# Altium schematic sheet MM32F3277_Balance.SchDoc
size A3
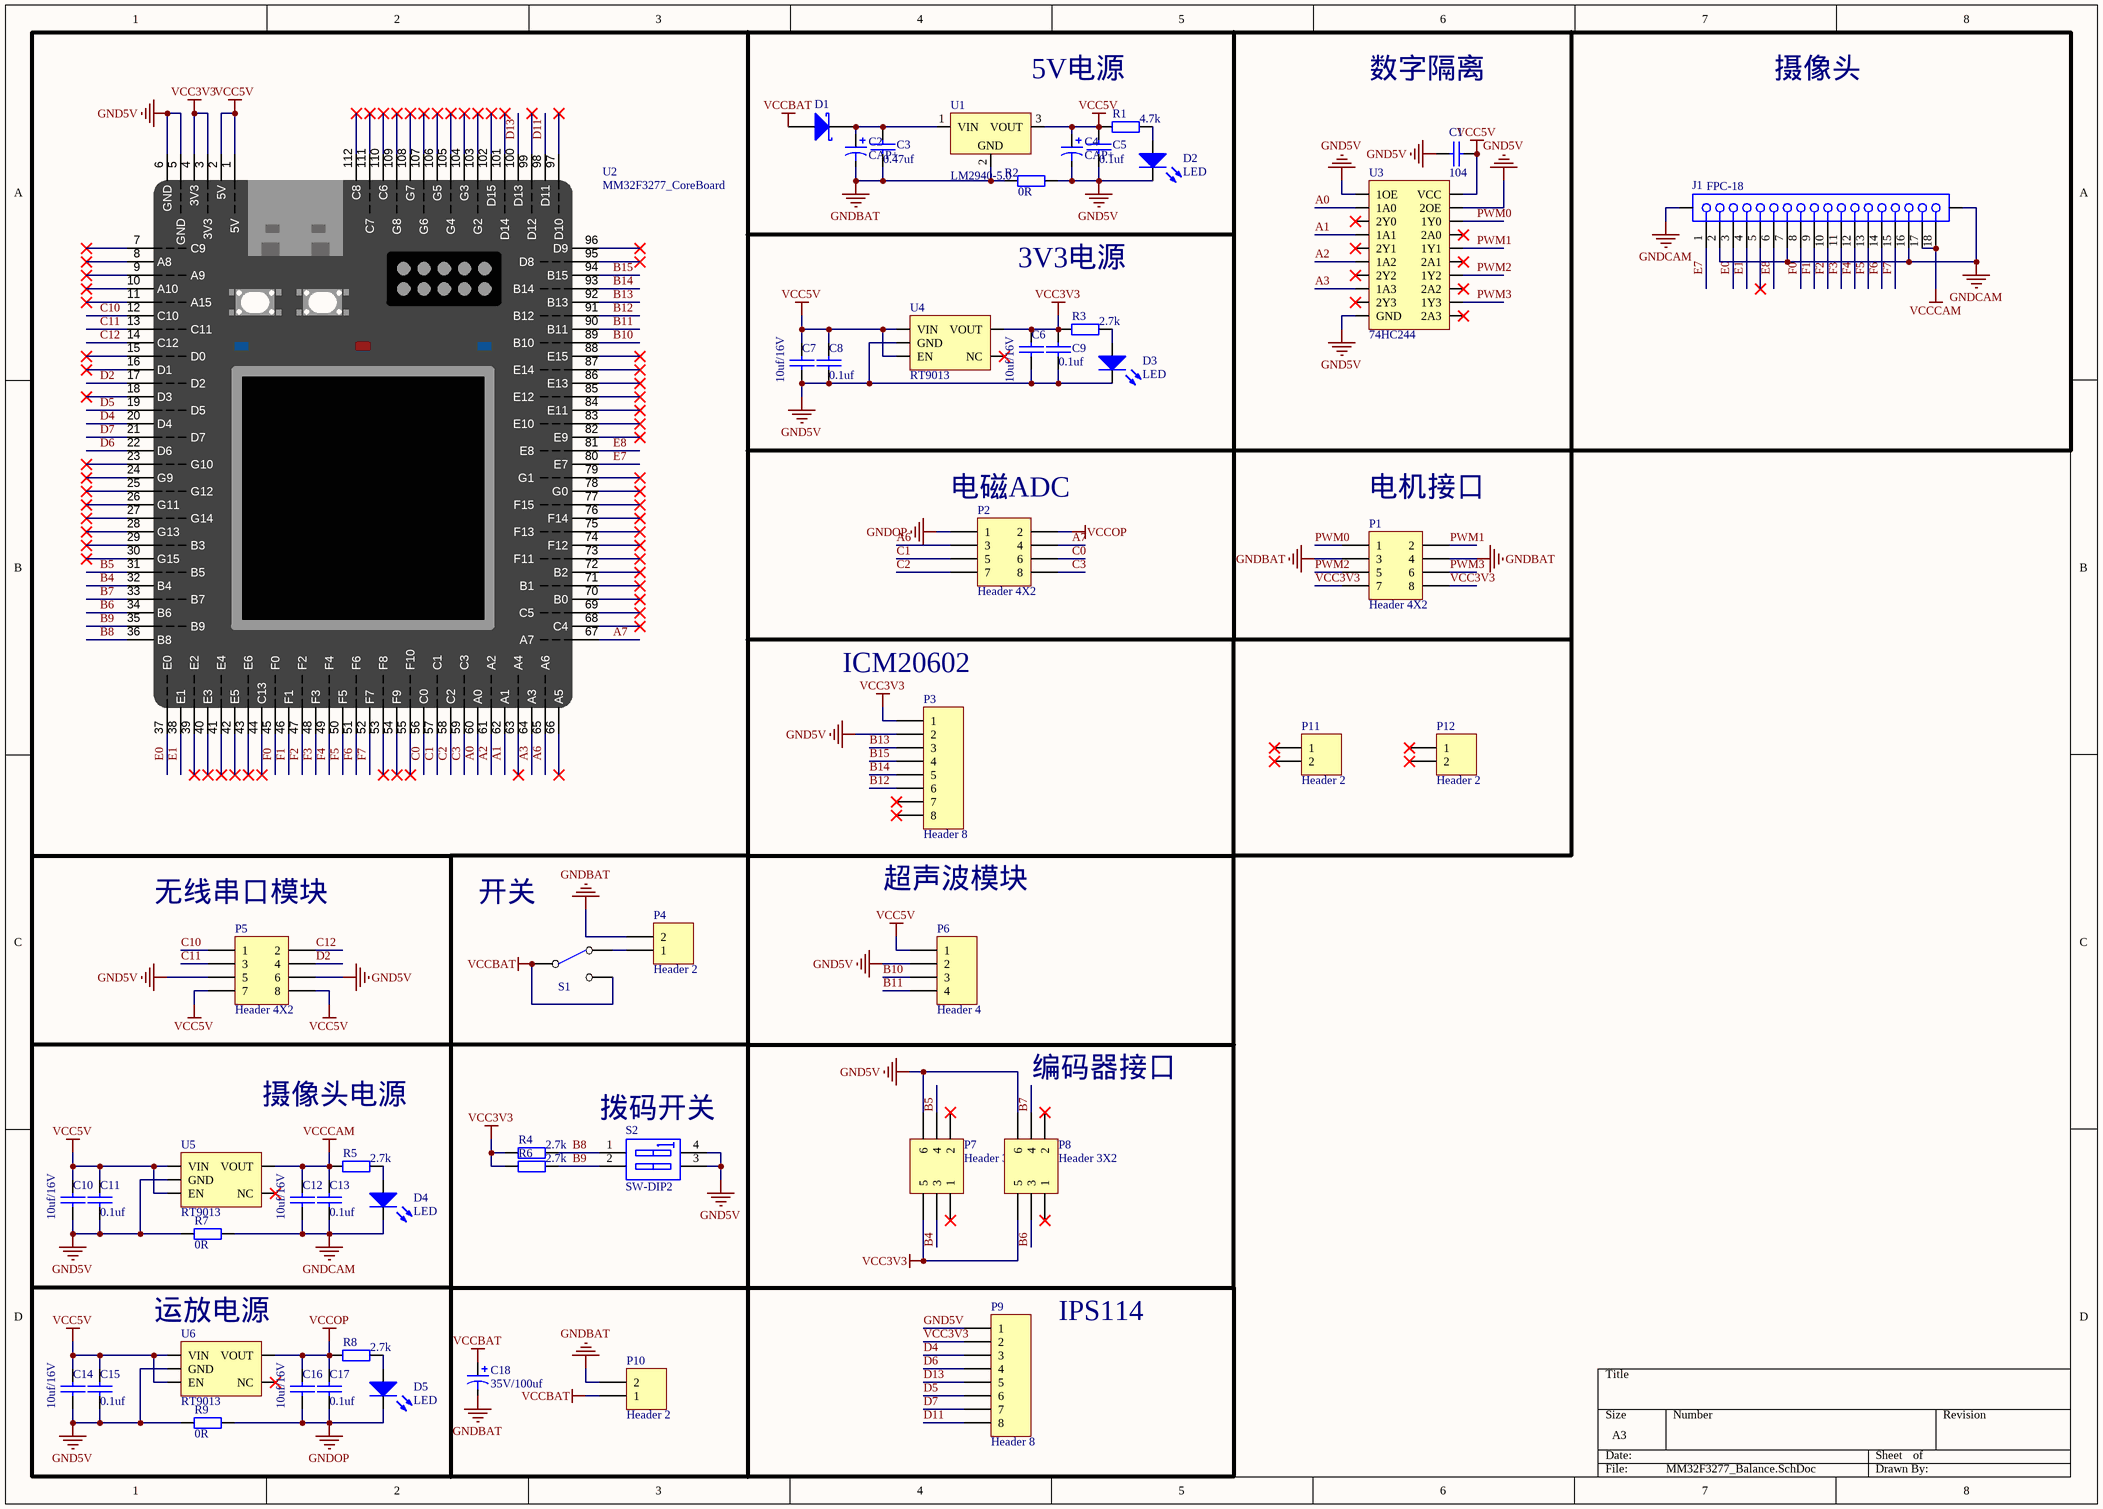
[diagram p0: MM32F3277_Balance.SchDoc]

## Parts
C1  104  [0603C]
C2  CAP+  [CS 2.5*6.3*11 - V]
C3  0.47uf  [0603C]
C4  CAP+  [CS 2.5*6.3*7 - R]
C5  0.1uf  [0603C]
C6  10uf/16V  [1206C]
C7  10uf/16V  [1206C]
C8  0.1uf  [0603C]
C9  0.1uf  [0603C]
C10  10uf/16V  [1206C]
C11  0.1uf  [0603C]
C12  10uf/16V  [1206C]
C13  0.1uf  [0603C]
C14  10uf/16V  [1206C]
C15  0.1uf  [0603C]
C16  10uf/16V  [1206C]
C17  0.1uf  [0603C]
C18  35V/100uf  [CS 2.5*6.3*7 - R]
D1  DIODE3  [SMA - duplicate]  (value not drawn)
D2  LED  [LED 0603W]
D3  LED  [LED 0603W]
D4  LED  [LED 0603W]
D5  LED  [LED 0603W]
J1  FPC-18  [FPC0.5 2H-WS-18P]
P1  Header 4X2  [HDR2X4]
P2  Header 4X2  [HDR2X4]
P3  Header 8  [XH2.54-LI-8P]
P4  Header 2  [T型头]
P5  Header 4X2  [HDR2X4]
P6  Header 4  [HDR1X4]
P7  Header 3X2  [HDR2X3]
P8  Header 3X2  [HDR2X3]
P9  Header 8  [HDR1X8]
P10  Header 2  [电源焊孔]
P11  Header 2  [HDR1X2]
P12  Header 2  [HDR1X2]
R1  4.7k  [0603R]
R2  0R  [0603R]
R3  2.7k  [0603R]
R4  2.7k  [0603R]
R5  2.7k  [0603R]
R6  2.7k  [0603R]
R7  0R  [0603R]
R8  2.7k  [0603R]
R9  0R  [0603R]
S1  双刀单柄开关  [MTS-10x]  (value not drawn)
S2  SW-DIP2  [CSW DIP-2P_G]
U1  LM2940-5.0  [SOT-223]
U2  MM32F3277_CoreBoard  [MM32F3277_CoreBoard]
U3  74HC244  [TSSOP20]
U4  RT9013  [SOT23-5]
U5  RT9013  [SOT23-5]
U6  RT9013  [SOT23-5]

## Blocks framed on the sheet
无线串口模块: P5

## Nets
GND5V: C1.1 C4.2 C5.1 C6.1 C7.1 C8.1 C9.1 C10.1 C11.1 C14.1 C15.1 D2.2(K) D3.2(K) P3.2 P5.5 P5.6 P6.2 P7.6 P8.6 P9.1 R2.2 R7.1 R9.1 S2.3(B2) S2.4(B1) U2.5(GND) U2.6(GND) U3.1(1OE) U3.10(GND) U3.19(2OE) U4.2(GND) U5.2(GND) U6.2(GND)
GNDBAT: C2.2 C3.1 C18.2 P1.3 P1.4 P4.2 P10.2 R2.1 U1.2(GND)
GNDCAM: C12.1 C13.1 D4.2(K) J1.0 J1.2 J1.7 J1.16 R7.2
GNDOP: C16.1 C17.1 D5.2(K) P2.1 R9.2
VCC3V3: C6.2 C9.2 P1.7 P1.8 P3.1 P7.5 P8.5 P9.2 R3.1 R4.1 R6.1 U2.3(3V3) U2.4(3V3) U4.5(VOUT)
VCC5V: C1.2 C4.1 C5.2 C7.2 C8.2 C10.2 C11.2 C14.2 C15.2 P5.7 P5.8 P6.1 R1.1 U1.3(VOUT) U2.1(5V) U2.2(5V) U3.20(VCC) U4.1(VIN) U4.3(EN) U5.1(VIN) U5.3(EN) U6.1(VIN) U6.3(EN)
VCCBAT: C18.1 D1.1(A) P10.1 S1.2(COMMON) S1.3(NO)
VCCCAM: C12.2 C13.2 J1.17 J1.18 R5.1 U5.5(VOUT)
VCCOP: C16.2 C17.2 P2.2 R8.1 U6.5(VOUT)
A0: U2.60(A0) U3.2(1A0)
A1: U2.62(A1) U3.4(1A1)
A2: U2.61(A2) U3.6(1A2)
A3: U2.64(A3) U3.8(1A3)
A6: P2.3 U2.65(A6)
A7: P2.4 U2.67(A7)
B4: P7.3 U2.32(B4)
B5: P7.4 U2.31(B5)
B6: P8.3 U2.34(B6)
B7: P8.4 U2.33(B7)
B8: R4.2 S2.1(A1) U2.36(B8)
B9: R6.2 S2.2(A2) U2.35(B9)
B10: P6.3 U2.89(B10)
B11: P6.4 U2.90(B11)
B12: P3.6 U2.91(B12)
B13: P3.3 U2.92(B13)
B14: P3.5 U2.93(B14)
B15: P3.4 U2.94(B15)
C0: P2.6 U2.56(C0)
C1: P2.5 U2.57(C1)
C2: P2.7 U2.58(C2)
C3: P2.8 U2.59(C3)
C10: P5.1 U2.12(C10)
C11: P5.3 U2.13(C11)
C12: P5.2 U2.14(C12)
D2: P5.4 U2.17(D2)
D4: P9.3 U2.20(D4)
D5: P9.6 U2.19(D5)
D6: P9.4 U2.22(D6)
D7: P9.7 U2.21(D7)
D11: P9.8 U2.98(D11)
D13: P9.5 U2.100(D13)
E0: J1.3 U2.37(E0)
E1: J1.4 U2.38(E1)
E7: J1.1 U2.80(E7)
E8: J1.6 U2.81(E8)
F0: J1.8 U2.45(F0)
F1: J1.9 U2.46(F1)
F2: J1.10 U2.47(F2)
F3: J1.11 U2.48(F3)
F4: J1.12 U2.49(F4)
F5: J1.13 U2.50(F5)
F6: J1.14 U2.51(F6)
F7: J1.15 U2.52(F7)
PWM0: P1.1 U3.18(1Y0)
PWM1: P1.2 U3.16(1Y1)
PWM2: P1.5 U3.14(1Y2)
PWM3: P1.6 U3.12(1Y3)
NetC2_1: C2.1 C3.2 D1.2(K) U1.1(VIN)
NetD2_1: D2.1(A) R1.2
NetD3_1: D3.1(A) R3.2
NetD4_1: D4.1(A) R5.2
NetD5_1: D5.1(A) R8.2
NetP4_1: P4.1 S1.1(NC)

Not connected (* = marked no-connect by the designer): J1 5*; P3 7* 8*; P7 1* 2*; P8 1* 2*; P11 1* 2*; P12 1* 2*; U2 7(C9)* 8(A8)* 9(A9)* 10(A10)* 11(A15)* 15(D0)* 16(D1)* 18(D3)* 23(G10)* 24(G9)* 25(G12)* 26(G11)* 27(G14)* 28(G13)* 29(B3)* 30(G15)* 39(E2)* 40(E3)* 41(E4)* 42(E5)* 43(E6)* 44(C13)* 53(F8)* 54(F9)* 55(F10)* 63(A4)* 66(A5)* 68(C4)* 69(C5)* 70(B0)* 71(B1)* 72(B2)* 73(F11)* 74(F12)* 75(F13)* 76(F14)* 77(F15)* 78(G0)* 79(G1)* 82(E9)* 83(E10)* 84(E11)* 85(E12)* 86(E13)* 87(E14)* 88(E15)* 95(D8)* 96(D9)* 97(D10)* 99(D12)* 101(D14)* 102(D15)* 103(G2)* 104(G3)* 105(G4)* 106(G5)* 107(G6)* 108(G7)* 109(G8)* 110(C6)* 111(C7)* 112(C8)*; U3 3(2Y0)* 5(2Y1)* 7(2Y2)* 9(2Y3)* 11(2A3)* 13(2A2)* 15(2A1)* 17(2A0)*; U4 4(NC)*; U5 4(NC)*; U6 4(NC)*

## Notes on the sheet
- 5V电源
- 数字隔离
- 摄像头
- 3V3电源
- (near P2) 电磁ADC
- (near P1) 电机接口
- (near P3) ICM20602
- 开关
- 超声波模块
- 摄像头电源
- (near S2) 拨码开关
- 编码器接口
- (near U6) 运放电源
- IPS114

## Library data of the parts
C1 C3 C5-C17 = CAP: Capacitor
C2 C4 C18 = CAP+: Capacitor
D1 = DIODE3: Note: Pin 2 is not connected and not drawn.; Published: 21-Mar-2003; LatestRevisionDate: 29-May-2009; LatestRevisionNote: IPC-7351 Footprint Added.; DatasheetVersion: Oct-1999; PackageVersion: Sep-2001; PackageReference: SOT-23; Publisher: Altium Limited; PackageDescription: 3-Pin SOT-23 Package 0.95 mm Pitch, 2.5 mm Lead Span; ComponentLink1Description: Manufacturer Link; ComponentLink1URL: http://www.infineon.com/; ComponentLink2Description: Datasheet; ComponentLink2URL: http://www.infineon.com/upload/Document/cmc_upload/documents/009/363/bat17series.pdf
P1 P2 P5 = Header 4X2: Header, 4-Pin, Dual row; LatestRevisionDate: 17-Jul-2002; LatestRevisionNote: Re-released for DXP Platform.; Publisher: Altium Limited
P3 P9 = Header 8: Header, 8-Pin; LatestRevisionDate: 17-Jul-2002; LatestRevisionNote: Re-released for DXP Platform.; Publisher: Altium Limited
P4 P10-P12 = Header 2: Header, 2-Pin; LatestRevisionDate: 17-Jul-2002; LatestRevisionNote: Re-released for DXP Platform.; Publisher: Altium Limited
P6 = Header 4: Header, 4-Pin; LatestRevisionDate: 17-Jul-2002; LatestRevisionNote: Re-released for DXP Platform.; Publisher: Altium Limited
P7 P8 = Header 3X2: Header, 3-Pin, Dual row; LatestRevisionDate: 17-Jul-2002; LatestRevisionNote: Re-released for DXP Platform.; Publisher: Altium Limited
R1-R9 = Res: Resistor
S2 = SW-DIP2: DIP Switch
U2 = MM32F3277_CoreBoard: 逐飞科技MM32F3277核心板